# Altium schematic sheet SIM.SchDoc
size A
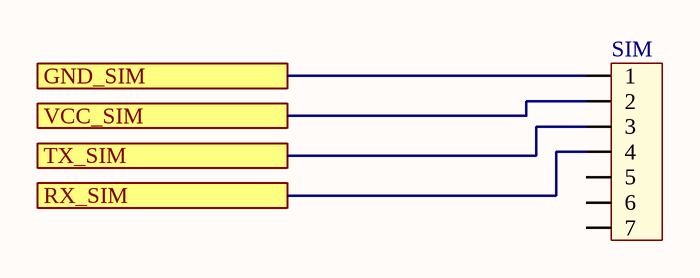
[diagram p0: SIM.SchDoc]

## Parts
SIM  Header 7P 2.54 Duc Thang  [XH2.54M-7]  (value not drawn)

## Ports
GND_SIM, RX_SIM, TX_SIM, VCC_SIM

## Nets
GND_SIM: SIM.1 ; port GND_SIM
RX_SIM: SIM.4 ; port RX_SIM
TX_SIM: SIM.3 ; port TX_SIM
VCC_SIM: SIM.2 ; port VCC_SIM

Not connected (* = marked no-connect by the designer): SIM 5 6 7

## Library data of the parts
SIM = Header 7P 2.54 Duc Thang: Cắm; Ten_Linh_Kien: Header 7P XH2.54-7P Đực Thẳng; Don_Vi: Con; Ma_Hang: MH003369; Chung_Loai: Cắm